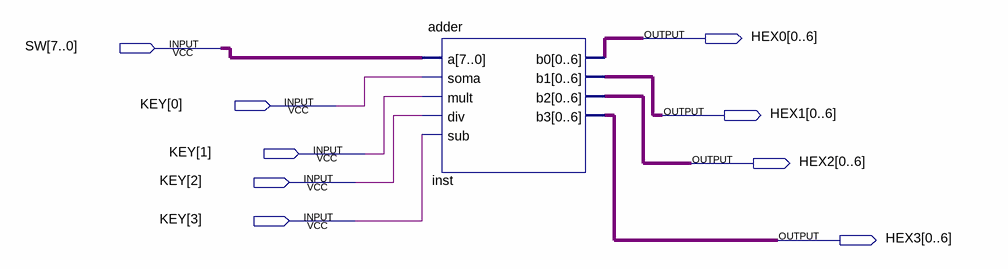
[diagram p0: schematic sheet]
// Quartus schematic topshow.bdf as structural Verilog: 1 symbols, 9 pins
module topshow (
  input  [7:0] SW,
  input  [3:0] KEY,
  output [0:6] HEX0,
  output [0:6] HEX1,
  output [0:6] HEX2,
  output [0:6] HEX3
);

  adder inst (
    .a(SW), .soma(KEY[0]), .mult(KEY[1]), .div(KEY[2]), .sub(KEY[3]), .b0(HEX0), .b1(HEX1), .b2(HEX2),
    .b3(HEX3));
endmodule
